# Altium schematic sheet P01 NOTE $ TITLE.SchDoc
size 297 x 209 mm
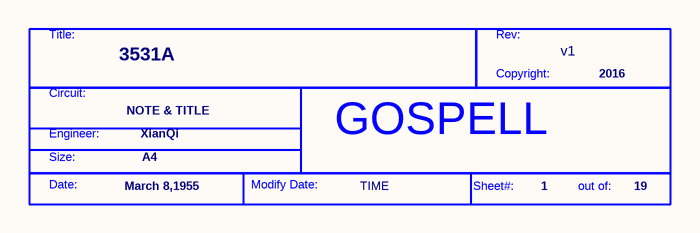
[diagram p0: P01 NOTE $ TITLE.SchDoc]

## Parts
*  Page Modify Date: TIME  Engineer: XianQi  Copyright: 2016  Title: 3531A  RevCode: v1  Page Size: A4  Page Create Date: March 8,1955  Page Number: 1  Page Count: 19  Doc: NOTE & TITLE  (hidden comment: GOSPELL)  (graphical)

## Notes on the sheet
- (in symbol GOSPELL) Title:; Rev:; Copyright:; Circuit:; Engineer:; Size:; Date:; Modify Date:; Sheet#:; out of: